# Altium schematic sheet 2 power supply.SchDoc
size A4; SheetNumber: 2; SheetTotal: 6
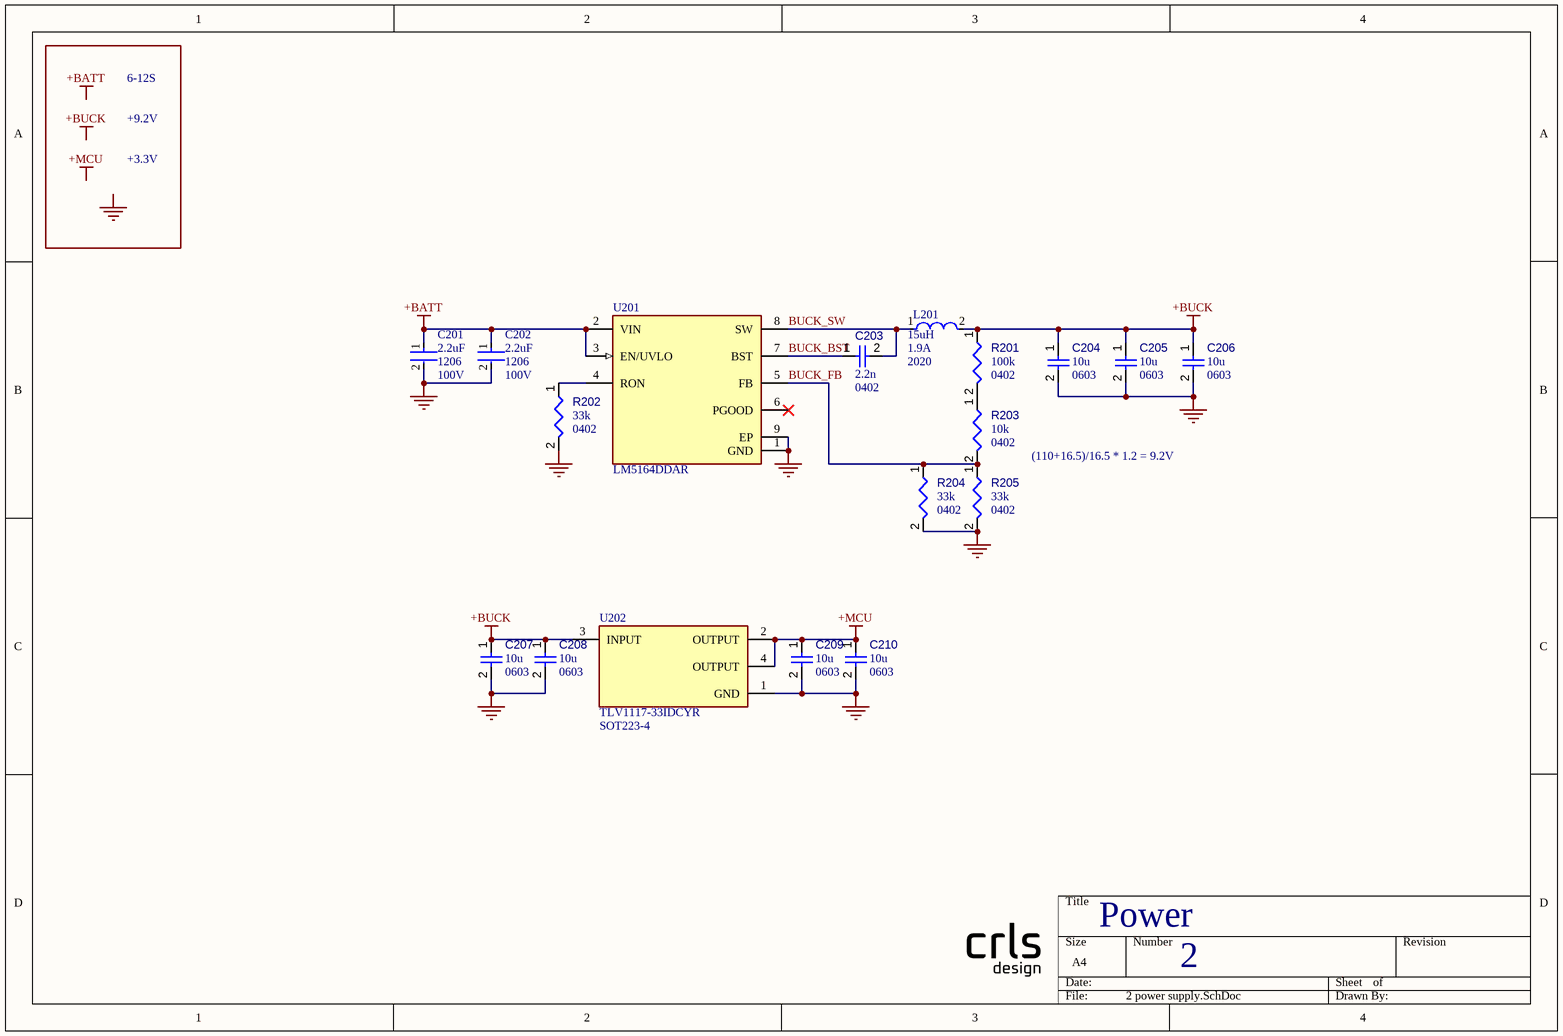
[diagram p0: 2 power supply.SchDoc]

## Parts
C201  Voltage Rating: 100V  Case/Package: 1206  Capacitance: 2.2uF  [FP-CC1206-0_3-1_9-MFG]  (hidden comment: CC1206KKX7R0BB225)
C202  Voltage Rating: 100V  Case/Package: 1206  Capacitance: 2.2uF  [FP-CC1206-0_3-1_9-MFG]  (hidden comment: CC1206KKX7R0BB225)
C203  value 2.2n  Case/Package: 0402  [CAPC0402(1005)60_L]  (hidden comment: Capacitors,ceramic,0402,10%,2.2n,50V)
C204  value 10u  Case/Package: 0603  [CAPC0603(1608)100_L]  (hidden comment: Capacitors,ceramic,0603,20%,10u,25V)
C205  value 10u  Case/Package: 0603  [CAPC0603(1608)100_L]  (hidden comment: Capacitors,ceramic,0603,20%,10u,25V)
C206  value 10u  Case/Package: 0603  [CAPC0603(1608)100_L]  (hidden comment: Capacitors,ceramic,0603,20%,10u,25V)
C207  value 10u  Case/Package: 0603  [CAPC0603(1608)100_L]  (hidden comment: Capacitors,ceramic,0603,20%,10u,25V)
C208  value 10u  Case/Package: 0603  [CAPC0603(1608)100_L]  (hidden comment: Capacitors,ceramic,0603,20%,10u,25V)
C209  value 10u  Case/Package: 0603  [CAPC0603(1608)100_L]  (hidden comment: Capacitors,ceramic,0603,20%,10u,25V)
C210  value 10u  Case/Package: 0603  [CAPC0603(1608)100_L]  (hidden comment: Capacitors,ceramic,0603,20%,10u,25V)
L201  Case/Package: 2020  Current Rating: 1.9A  Inductance: 15uH  [FP-IHLP-2020CZ-FP_1_905x2-MFG]  (hidden comment: IHLP2020CZER150M01)
R201  value 100k  Case/Package: 0402  [RESC0402(1005)_L]  (hidden comment: Resistors,0402,1%,100k)
R202  value 33k  Case/Package: 0402  [RESC0402(1005)_L]  (hidden comment: Resistors,0402,1%,33k)
R203  value 10k  Case/Package: 0402  [RESC0402(1005)_L]  (hidden comment: Resistors,0402,1%,10k)
R204  value 33k  Case/Package: 0402  [RESC0402(1005)_L]  (hidden comment: Resistors,0402,1%,33k)
R205  value 33k  Case/Package: 0402  [RESC0402(1005)_L]  (hidden comment: Resistors,0402,1%,33k)
U201  LM5164DDAR  [FP-DDA0008E-IPC_C]
U202  TLV1117-33IDCYR  Package: SOT223-4  [FP-DCY0004A-MFG]

## Nets
+BATT: C201.1 C202.1 U201.2(VIN) U201.3(EN/UVLO)
+BUCK: C204.1 C205.1 C206.1 C207.1 C208.1 L201.2 R201.1 U202.3(INPUT)
+MCU: C209.1 C210.1 U202.2(OUTPUT) U202.4(OUTPUT)
GND: C201.2 C202.2 C204.2 C205.2 C206.2 C207.2 C208.2 C209.2 C210.2 R202.2 R204.2 R205.2 U201.1(GND) U201.9(EP) U202.1(GND)
BUCK_BST: C203.1 U201.7(BST)
BUCK_FB: R203.2 R204.1 R205.1 U201.5(FB)
BUCK_SW: C203.2 L201.1 U201.8(SW)
NetR201_2: R201.2 R203.1
NetR202_1: R202.1 U201.4(RON)

Not connected (* = marked no-connect by the designer): U201 6(PGOOD)*

## Notes on the sheet
- 6-12S
- +9.2V
- +3.3V
- (110+16.5)/16.5 * 1.2 = 9.2V
- Power
- Labels drawn without touching a wire or pin: +BATT, +BUCK, +MCU, GND

## Library data of the parts
C201 C202 = CMP-03422-001455-1: CAP CER 2.2UF 100V X7R 1206; Tolerance: 10%; Mount: Surface Mount; Packaging: Tape and Reel; Length: 0.126inch; Max Operating Temperature: 125°C; Min Operating Temperature: -55°C; Width: 0.063inch; Thickness: 0.057inch
C203-C210 = Capacitors: Capacitor; Capacitor Type: ceramic; Component Type: Capacitors
  C203: Voltage Rating: 50V; Tolerance: 10%
  C204-C210: Voltage Rating: 25V; Tolerance: 20%
L201 = CMP-02424-000144-1: Fixed Inductors Commercial High Saturation Series 15uH 1.9A 265mΩ 20%; Test Frequency: 100kHz; DC Resistance (DCR): 265mR; Saturation Current: 2.5A; Core Material: Metal; Self Resonant Frequency: 5MHz; Shielding: Shielded; Height: 3mm; Max Operating Temperature: 125°C; Military Standard: Not; Package Quantity: 2000; Tolerance: 20%; Depth: 5.43mm; Packaging: Tape and Reel; Lead Free: Lead Free; Min Operating Temperature: -55°C; Radiation Hardening: No; Mount: Surface Mount; Height - Seated (Max): 0.118inch; Length: 5.49mm; Width: 0.204inch; Termination: SMD/SMT; Max DC Current: 2.5A
R201-R205 = Resistors: Resistor; Tolerance: 1%; Component Type: Resistors
U201 = CMP-04918-000011-1: POWER MANAGEMENT; Manufacturer: Texas Instruments; Standoff Height: 0mm; Max Supply Voltage: 100V; Output Voltage: 1.2-90V; Max Duty Cycle: 99%; Nominal Supply Current: 600uA; Output Current: 1A; Min Supply Voltage: 6V; Output Type: AdjustableProgrammable; Max Junction Temp: +150°C; Number Of Outputs: 1; Switching Frequency: 1000kHz; Switching Topology: Buck; Temperature: -40°C to +150°C; Device Class L1: Integrated Circuits (ICs); Automotive: No; Lead Free: Yes; Package: DDA0008E; Device Class L3: Voltage Regulators - Switching; Manufacturer Part Number: LM5164DDAR; Device Class L2: Power Management ICs; RoHS: TRUE; Mouser Description: 6-V to 100-V input, 1-A synchronous buck DC-DC converter with ultra-low IQ 8-SO PowerPAD -40 to 150; Temperature Range Low: -40°C; ComponentLink2Description: Datasheet; Temperature Range High: +150°C; ComponentLink2URL: http://www.ti.com/lit/ds/symlink/lm5164.pdf; Digikey Description: POWER MANAGEMENT; Category: IC; Octopart: https://octopart.com/lm5164ddar-texas+instruments-96785744
U202 = CMP-04917-000056-1: IC REG LIN 3.3V 800MA SOT223-4; Manufacturer: Texas Instruments; Nominal Supply Current: 5mA; Dropout Voltage: 1.2V; Max Supply Voltage: 15V; Min Supply Voltage: 4.7V; Output Type: Fixed; Number Of Outputs: 1; Output Current: 0.8A; Standoff Height: 0.02mm; Max Junction Temp: +125°C; Lead Free: Yes; RoHS: TRUE; Temperature: -40°C to +125°C; Device Class L1: Integrated Circuits (ICs); Output Voltage: 3.3V; Device Class L3: Voltage Regulators - Linear; Octopart: https://octopart.com/tlv1117-33idcyr-texas+instruments-669250; Device Class L2: Power Management ICs; Temperature Range High: +125°C; Category: IC; Height: 1.8mm; Automotive: No; Digikey Description: IC REG LIN 3.3V 800MA SOT223-4; Temperature Range Low: -40°C; ComponentLink2URL: http://www.ti.com/lit/ds/symlink/tlv1117.pdf; ComponentLink2Description: Datasheet; Manufacturer Part Number: TLV1117-33IDCYR; Mouser Description: LDO Voltage Regulators Fixed LDO Volt Reg